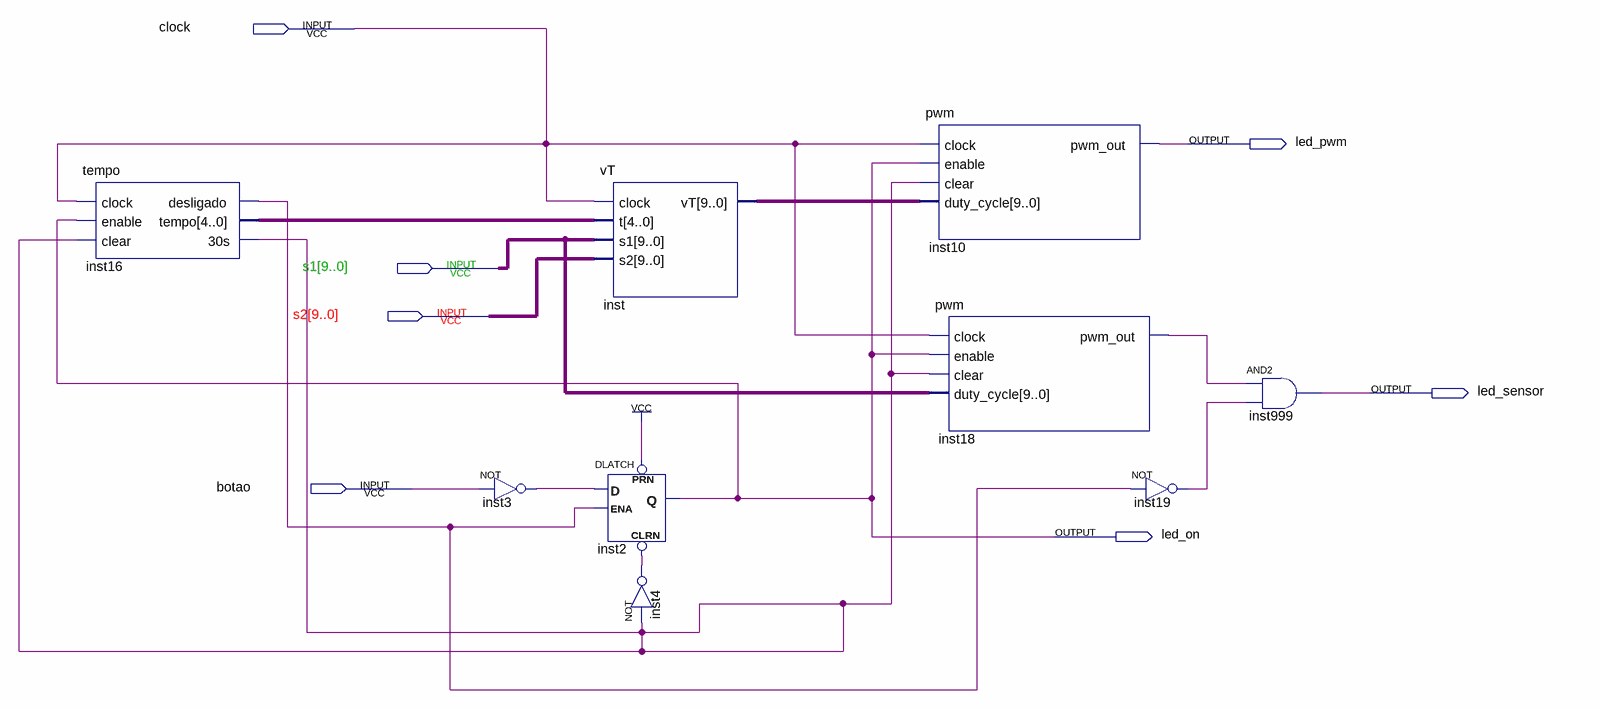
[diagram p0: schematic sheet]
// Quartus schematic main.bdf as structural Verilog: 9 symbols, 7 pins
module main (
  input  clock,
  input  [9:0] s1,
  input  [9:0] s2,
  input  botao,
  output led_pwm,
  output led_sensor,
  output led_on
);

  wire inst3_out, inst4_out, inst16_30s, inst16_desligado, inst18_pwm_out, inst19_out;
  wire [4:0] inst16_tempo;
  wire [9:0] inst_vt;

  tempo inst16 (
    .clock(clock), .enable(led_on), .clear(inst16_30s), .desligado(inst16_desligado), .tempo(inst16_tempo),
    .\30s (inst16_30s));
  not inst3 (inst3_out, botao);
  vT inst (.clock(clock), .t(inst16_tempo), .s1(s1), .s2(s2), .vT(inst_vt));
  DLATCH inst2 (.CLRN(inst4_out), .D(inst3_out), .ENA(inst16_desligado), .PRN(1'b1), .Q(led_on));
  not inst4 (inst4_out, inst16_30s);
  pwm inst10 (.clock(clock), .enable(led_on), .clear(inst16_30s), .duty_cycle(inst_vt), .pwm_out(led_pwm));
  pwm inst18 (.clock(clock), .enable(led_on), .clear(inst16_30s), .duty_cycle(s1), .pwm_out(inst18_pwm_out));
  not inst19 (inst19_out, inst16_desligado);
  and inst999 (led_sensor, inst18_pwm_out, inst19_out);
endmodule
